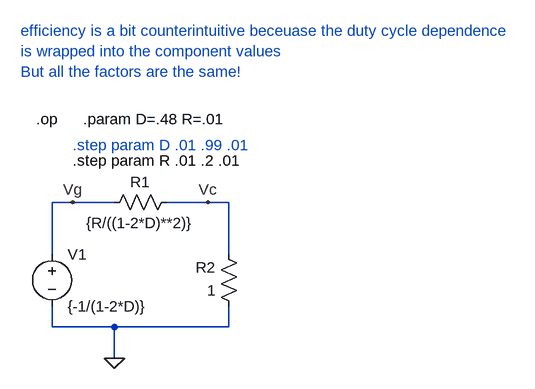
[diagram p0: schematic HBridgeDraft4.asc]
HBridgeDraft4.asc, the LTspice schematic file:
Version 4
SHEET 1 1284 680
WIRE 112 96 80 96
WIRE 176 96 112 96
WIRE 320 96 256 96
WIRE 352 96 320 96
WIRE 80 176 80 96
WIRE 352 176 352 96
WIRE 80 288 80 256
WIRE 176 288 80 288
WIRE 352 288 352 256
WIRE 352 288 176 288
WIRE 176 336 176 288
FLAG 176 336 0
FLAG 320 96 Vc
FLAG 112 96 Vg
SYMBOL voltage 80 160 R0
WINDOW 123 0 0 Left 0
WINDOW 39 0 0 Left 0
SYMATTR InstName V1
SYMATTR Value {-1/(1-2*D)}
SYMBOL res 272 80 R90
WINDOW 0 0 56 VBottom 2
WINDOW 3 32 56 VTop 2
SYMATTR InstName R1
SYMATTR Value {R/((1-2*D)**2)}
SYMBOL res 368 272 R180
WINDOW 0 36 76 Left 2
WINDOW 3 36 40 Left 2
SYMATTR InstName R2
SYMATTR Value 1
TEXT 128 -32 Left 2 !.param D=.48 R=.01
TEXT 112 8 Left 2 ;.step param D .01 .99 .01
TEXT 56 -32 Left 2 !.op
TEXT 32 -168 Left 2 ;efficiency is a bit counterintuitive beceuase the duty cycle dependence \nis wrapped into the component values\nBut all the factors are the same!
TEXT 112 32 Left 2 !.step param R .01 .2 .01

The netlist it stands for:
* HBridgeDraft4.asc
V1 Vg 0 {-1/(1-2*D)}
R1 Vc Vg {R/((1-2*D)**2)}
R2 0 Vc 1
.param D=.48 R=.01
* .step param D .01 .99 .01
.op
* efficiency is a bit counterintuitive beceuase the duty cycle dependence
* is wrapped into the component values
* But all the factors are the same!
.step param R .01 .2 .01
.backanno
.end

* Results of the author's LTspice run, read from the files saved beside the schematic
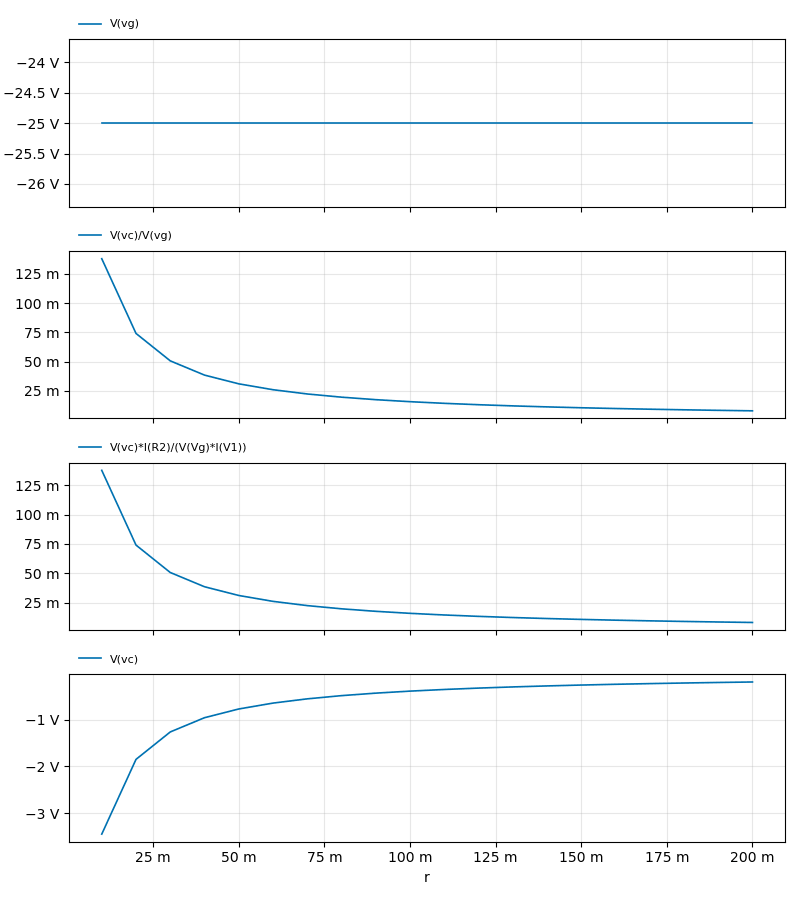
[diagram p1: Operating Point of HBridgeDraft4.asc, plotted from the saved traces]
* Operating Point, 1 run:
*   V(vg): -25 V at r=10 m, -25 V at r=200 m, min -25 V, max -25 V
*   V(vc)/V(vg): 137.9 m at r=10 m, 7.937 m at r=200 m, min 7.937 m, max 137.9 m
*   V(vc)*I(R2)/(V(Vg)*I(V1)): 137.9 m at r=10 m, 7.937 m at r=200 m, min 7.937 m, max 137.9 m
*   V(vc): -3.448 V at r=10 m, -198.4 mV at r=200 m, min -3.448 V, max -198.4 mV